# EAGLE schematic PowerElectronicMW (EAGLE 7.7.0)
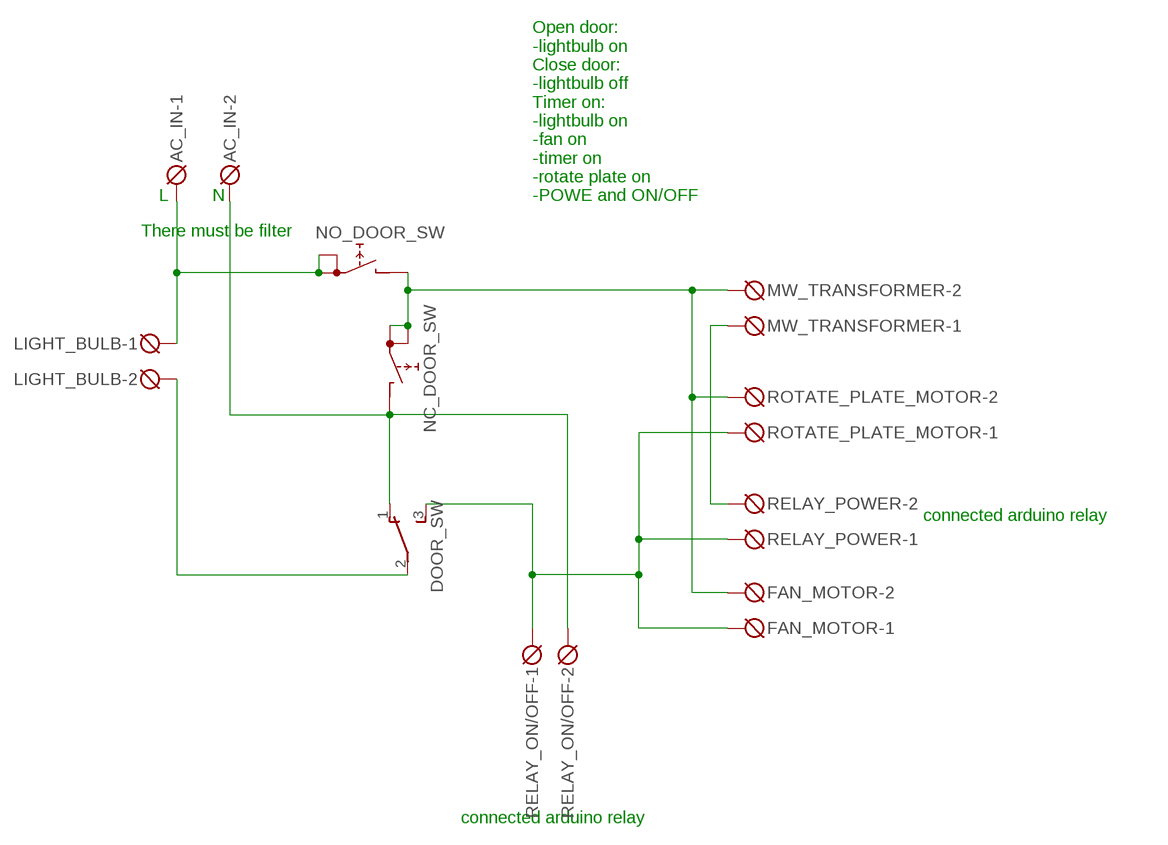
[diagram p0: schematic, sheet 1]

## Parts
AC_IN  DG3XX-02-5.0  [DG306-5.0-02P]
DOOR_SW  TL36PO  [TL3XPO]
FAN_MOTOR  DG3XX-02-5.0  [DG306-5.0-02P]
LIGHT_BULB  DG3XX-02-5.0  [DG306-5.0-02P]
MW_TRANSFORMER  DG3XX-02-5.0  [DG306-5.0-02P]
NC_DOOR_SW  RDT1034  [RDT1034]
NO_DOOR_SW  RDT1034  [RDT1034]
RELAY_ON/OFF  DG3XX-02-5.0  [DG306-5.0-02P]
RELAY_POWER  DG3XX-02-5.0  [DG306-5.0-02P]
ROTATE_PLATE_MOTOR  DG3XX-02-5.0  [DG306-5.0-02P]

## Nets
N$1: AC_IN.1 LIGHT_BULB.1 NO_DOOR_SW.A NO_DOOR_SW.A1
N$3: AC_IN.2 DOOR_SW.1(O) NC_DOOR_SW.B RELAY_ON/OFF.2
N$4: DOOR_SW.2(P) LIGHT_BULB.2
N$5: DOOR_SW.3(S) FAN_MOTOR.1 RELAY_ON/OFF.1 RELAY_POWER.1 ROTATE_PLATE_MOTOR.1
N$7: FAN_MOTOR.2 MW_TRANSFORMER.2 NC_DOOR_SW.A NC_DOOR_SW.A1 NO_DOOR_SW.B ROTATE_PLATE_MOTOR.2
N$11: MW_TRANSFORMER.1 RELAY_POWER.2

## Notes on the sheet
- L | N
- Open door:
  -lightbulb on
  Close door:
  -lightbulb off
  Timer on:
  -lightbulb on
  -fan on
  -timer on
  -rotate plate on
  -POWE and ON/OFF
- There must be filter
- connected arduino relay
- connected arduino relay

## Library data of the parts
AC_IN FAN_MOTOR LIGHT_BULB MW_TRANSFORMER RELAY_ON/OFF RELAY_POWER ROTATE_PLATE_MOTOR = degson:DG3XX-02: DG350-3.5-02P DG306-5.0-02P
DOOR_SW = switch:TL36PO: TINY SWITCH ON - ON Source: http://www2.produktinfo.conrad.com/datenblaetter/700000-724999/705152-da-01-de-Subminiaturschalter_TL_36YO.pdf
NC_DOOR_SW NO_DOOR_SW = switch:RDT1034: PUSH SWITCH www.radiohm.com